# Altium schematic sheet lab_1_arhipov_usb_i2c.SchDoc: =title_line_1 + title_line_2
size 420 x 297 mm; SheetNumber: n
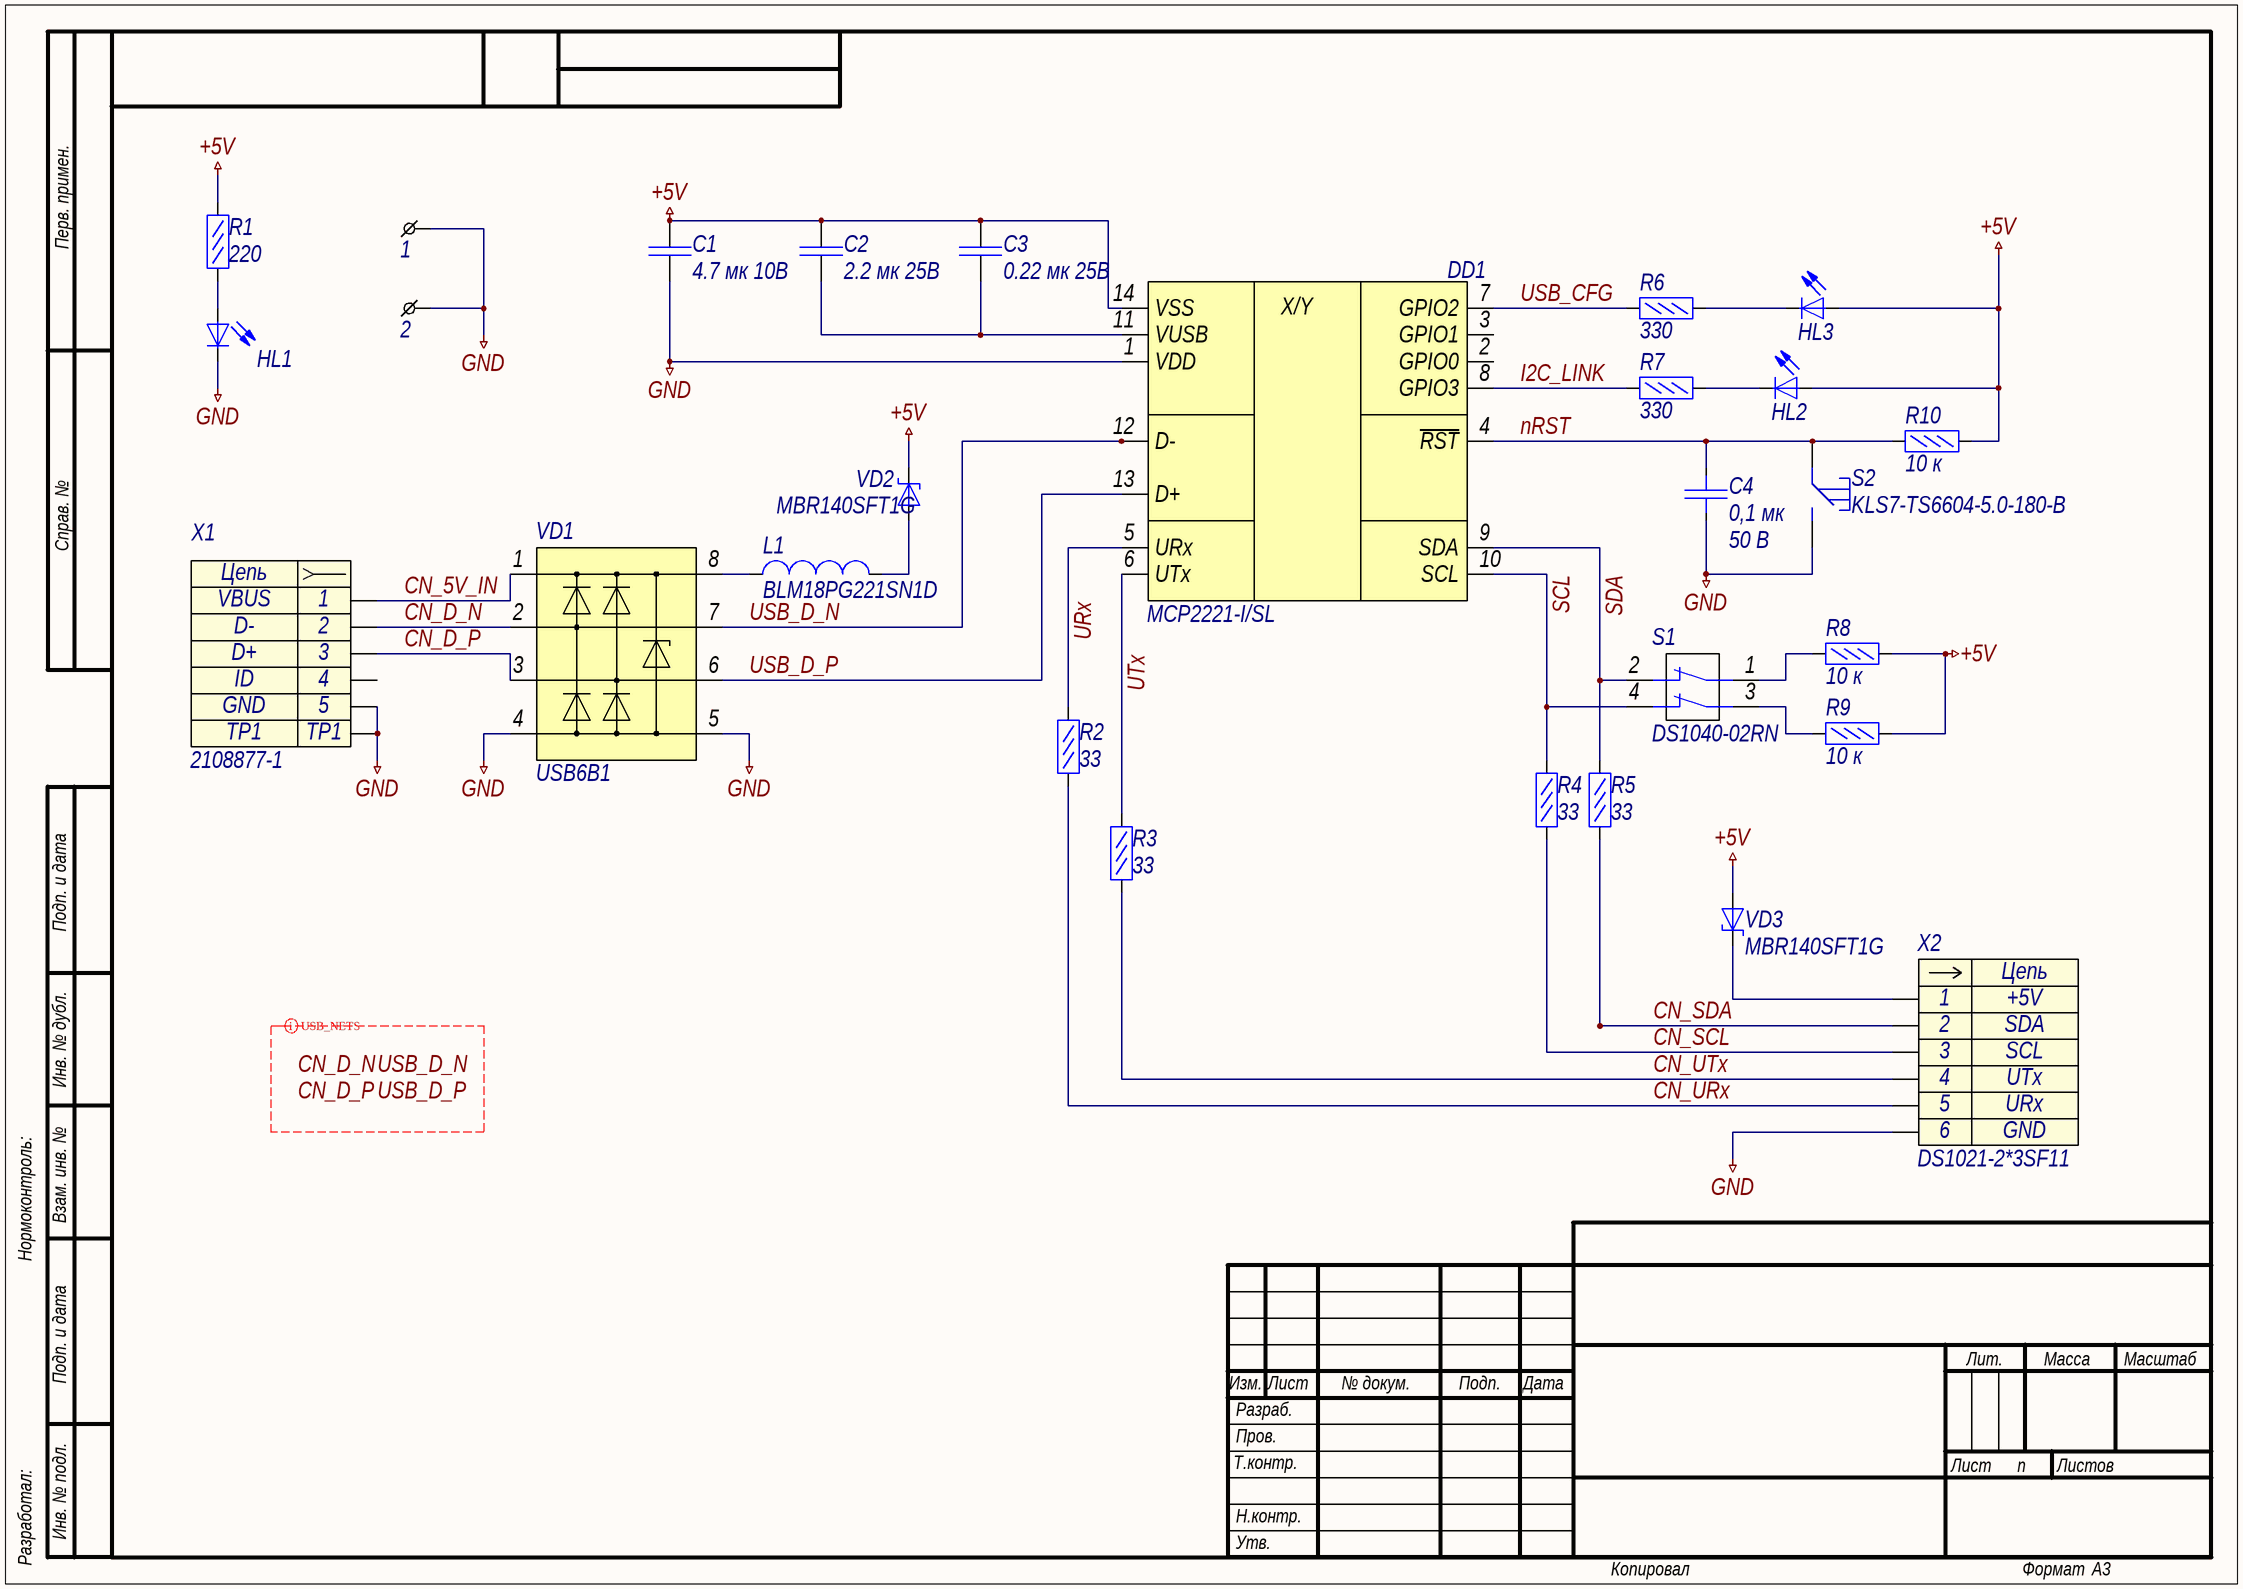
[diagram p0: lab_1_arhipov_usb_i2c.SchDoc]

## Parts
1  MOUNTING_HOLE  [HOLE_1,6X3,3]  (value not drawn)
2  MOUNTING_HOLE  [HOLE_1,6X3,3]  (value not drawn)
C1  4.7 мк 10В  [C0805]
C2  2.2 мк 25В  [C1206]
C3  0.22 мк 25В  [smd2220]
C4  0,1 мк  Напряжение: 50 В  [C0603]
DD1  MCP2221-I/SL  [SOIC127P600X175-14N]
HL1  KP-1608SGC  [D0603]  (value not drawn)
HL2  KP-1608SGC  [D0603]  (value not drawn)
HL3  KP-1608SGC  [D0603]  (value not drawn)
L1  BLM18PG221SN1D  [L0603]
R1  220  [R0603]
R2  33  [R0603]
R3  33  [R0603]
R4  33  [R0603]
R5  33  [R0603]
R6  330  [R0603]
R7  330  [R0603]
R8  10 к  [R0603]
R9  10 к  [R0603]
R10  10 к  [R0603]
S1  DS1040-02RN  [DS1040-02RN]
S2  KLS7-TS6604-5.0-180-B  [KLS7-TS6604_500]
VD1  USB6B1  [SO-8]
VD2  MBR140SFT1G  [SOD-123FL_290X180X98]
VD3  MBR140SFT1G  [SOD-123FL_290X180X98]
X1  2108877-1  [2108877-1]
X2  DS1021-2*3SF11  [PLS-2,54-2X3-THT-V]

## Nets
+5V: C1.2 C2.2 C3.2 DD1.14(VSS) HL2.1(A) HL3.1(A) R1.2 R8.2 R9.2 R10.2 VD2.2(K) VD3.1(A)
GND: 1.1 2.1 C1.1 C4.1 DD1.1(VDD) HL1.2(K) S2.2 VD1.4 VD1.5 X1.5 X1.TP1 X2.6
CN_5V_IN: VD1.1 X1.1
CN_D_N: VD1.2 X1.2
CN_D_P: VD1.3 X1.3
CN_SCL: R4.1 X2.3
CN_SDA: R5.1 X2.2
CN_URx: R2.1 X2.5
CN_UTx: R3.1 X2.4
I2C_LINK: DD1.8(GPIO3) R7.1
nRST: C4.2 DD1.4(~{RST}) R10.1 S2.1
SCL: DD1.10(SCL) R4.2 S1.4
SDA: DD1.9(SDA) R5.2 S1.2
URx: DD1.5(URx) R2.2
USB_CFG: DD1.7(GPIO2) R6.1
USB_D_N: DD1.12(D-) VD1.7
USB_D_P: DD1.13(D+) VD1.6
UTx: DD1.6(UTx) R3.2
NetC2_1: C2.1 C3.1 DD1.11(VUSB)
NetHL1_1: HL1.1(A) R1.1
NetHL2_2: HL2.2(K) R7.2
NetHL3_2: HL3.2(K) R6.2
NetL1_1: L1.1 VD1.8
NetL1_2: L1.2 VD2.1(A)
NetR8_1: R8.1 S1.1
NetR9_1: R9.1 S1.3
NetVD3_2: VD3.2(K) X2.1

Not connected (* = marked no-connect by the designer): DD1 2(GPIO0) 3(GPIO1); X1 4

## Layout directives
differential pair; rule Differential Pairs Routing [Pref Gap = 0.254mm    Min Gap  = 0.15mm    Max Gap  = 0.254mmPref Width = 0.381mm    Min Width  = 0.155mm    Max Width  = 0.381mm]; differential pair class USB_SIGNALS: CN_D_N, CN_D_P, USB_D_N, USB_D_P

## Notes on the sheet
- Labels drawn without touching a wire or pin: CN_D_N, CN_D_P, USB_D_N, USB_D_P
- Перв. примен.
- Справ. №
- Подп. и дата
- Инв. № дубл.
- Нормоконтроль:
- Взам. инв. №
- Изм.
- Лист
- № докум.
- Подп.
- Дата
- Лит.
- Масса
- Масштаб
- Т.контр.
- Пров.
- Разраб.
- Листов
- Разработал:
- Инв. № подл.
- Н.контр.
- Утв.
- Копировал
- Формат
- А3
- (in symbol 2108877-1_micro_usb-b) Цепь
- (in symbol DS1021-2*3SF11) Цепь
- (in symbol mcp2221) X/Y

## Library data of the parts
1 2 = Отверстие 1,6x3,3: id: fstn0011; Описание: Отверстие под М1,5; Диаметр отверстия: 1,6 мм; Параметры металлизации: 3,3 мм; Наименование: Отверстие 1,6x3,3
C1 = c0004: =Описание; ID: c0004; Фамилия: Архипов; Описание: Конденсатор чип 0805 4.7 мкФ 10 В; Наименование: CL21F475ZPFNNNE; Производитель: Samsung electro-mechanics; Отклонение: ±10 %; Рабочие температуры: от -55 °С до +125 °С; Корпус: 0805; Номинал: 4.7 мк 10В; Номинальное напряжение: 10В; HelpURL: https://static6.arrow.com/aropdfconversion/24268746ef1013a85114e321d5aafbc0d1e19c82/cl21f475zpfnnn_specsheet.pdf
C2 = c0003: =Описание; ID: c0003; Фамилия: Архипов; Описание: Конденсатор чип 1206 2.2 мкФ 25 В; Наименование: CL31B225KAHNNNE; Производитель: Samsung electro-mechanics; Отклонение: ±10 %; Рабочие температуры: от -55 °С до +125 °С; Корпус: 1206; Номинал: 2.2 мк 25В; Номинальное напряжение: 25В; HelpURL: https://www.datasheets360.com/pdf/7863126215795052319
C3 = c0002: =Описание; ID: c0002; Фамилия: Архипов; Описание: Конденсатор чип 0603 0.22 мкФ 25 В; Наименование: CL10B224KA8NNNC; Производитель: Samsung electro-mechanics; Отклонение: ±10 %; Рабочие температуры: от -55 °С до +125 °С; Корпус: 0603; Номинал: 0.22 мк 25В; Номинальное напряжение: 25 В; HelpURL: http://www.farnell.com/datasheets/2710631.pdf
C4 = CL10B104KB8NNN: Конденсатор; id: c0007; Фамилия: Черемный; Описание: Конденсатор керамический 0603 0,1 мкФ 50 В ±10 % X7R; Производитель: Samsung; Корпус: 0603; Отклонение: ±10 %; ТКЕ: X7R; Примечание: В наименовании убрана последняя буква, обозначающая упаковку; ClassName: *; Наименование: CL10B104KB8NNN; Номинал: 0,1 мк; HelpURL: http://weblib.samsungsem.com/mlcc/mlcc-ec-data-sheet.do?partNumber=CL10B104KB8NNN
DD1 = mcp2221
HL1-HL3 = KP-1608SGC: id: led0004; Фамилия: Капустин; Описание: Светодиод зеленый SMD 0603; Производитель: Kingbright; Цвет: Зеленый; Максимальное обратное напряжение: 5 В; Прямой ток: 20 мА; Максимальное прямое напряжение: 2,5 В; Максимальный обратный ток: 11 мкА; Максимальный импульсный прямой ток: 140 мА; Температура окружающей среды (корпуса), мин#: -40 °C; Температура окружающей среды (корпуса), макс#: +85 °C; Примечание: Не найти документацию на свйте производителя; ClassName: *; Наименование: KP-1608SGC; Корпус: D0603; HelpURL: http://www.farnell.com/datasheets/2045827.pdf?_ga=2.72147859.1066726363.1573580702-223521920.1573064505
L1 = BLM18PG221SN1D: id: ind0014; Фамилия: Капустин; Описание: Ферритовая бусина 220 Ом @ 100МГц; Производитель: Murata; Номинал: 220 Ом; Индуктивность: 220 Ом @ 100 МГц; Отклонение: ±25%; Сопротивление обмотки: 0,1 Ом; Максимальный ток: 1,4 А; Добротность: не указана; Температура окружающей среды (корпуса), мин#: -55 °C; Температура окружающей среды (корпуса), макс#: +125 °C; Корпус: 0603; ClassName: *; Наименование: BLM18PG221SN1D; HelpURL: https://www.murata.com/en-eu/products/productdetail?partno=BLM18PG221SN1%23
R1 = RC0603FR-07220RL: Резистор 0,063Вт; id: r0232; Фамилия: Капустин; Описание: Резистор чип 0603 220 Ом 0,1 Вт ±1 %; Производитель: YAGEO; Отклонение: ±1 %; Напряжение: 75 В; Температурный коэффициент сопротивления: 200 ppm; Температура окружающей среды (корпуса), мин#: -55 °C; Температура окружающей среды (корпуса), макс#: +155 °C; Корпус: 0603; ClassName: *; Наименование: RC0603FR-07220RL; Номинал: 220; HelpURL: https://www.yageo.com/upload/media/product/products/datasheet/rchip/PYu-RC_Group_51_RoHS_L_10.pdf
R2-R5 = RC0603FR-0733RL: Резистор 0,063Вт; id: r0214; Фамилия: Капустин; Описание: Резистор чип 0603 33 Ом 0,1 Вт ±1 %; Производитель: YAGEO; Отклонение: ±1 %; Напряжение: 75 В; Температурный коэффициент сопротивления: 200 ppm; Температура окружающей среды (корпуса), мин#: -55 °C; Температура окружающей среды (корпуса), макс#: +155 °C; Корпус: 0603; ClassName: *; Наименование: RC0603FR-0733RL; Номинал: 33; HelpURL: https://www.yageo.com/upload/media/product/products/datasheet/rchip/PYu-RC_Group_51_RoHS_L_10.pdf
R6 R7 = RC0603FR-07330RL: Резистор 0,063Вт; id: r0034; Фамилия: Капустин; Описание: Резистор чип 0603 300 Ом 0,1 Вт ±1 %; Производитель: YAGEO; Отклонение: ±1 %; Напряжение: 75 В; Температурный коэффициент сопротивления: 100 ppm; Температура окружающей среды (корпуса), мин#: -55 °C; Температура окружающей среды (корпуса), макс#: +155 °C; Корпус: 0603; ClassName: *; Наименование: RC0603FR-07330RL; Номинал: 330; HelpURL: https://www.yageo.com/upload/media/product/products/datasheet/rchip/PYu-RC_Group_51_RoHS_L_10.pdf
R8-R10 = RC0603FR-0710KL: Резистор 0,063Вт; id: r0006; Фамилия: Капустин; Описание: Резистор чип 0603 10 кОм 0,1 Вт ±1 %; Производитель: YAGEO; Отклонение: ±1 %; Напряжение: 75 В; Температурный коэффициент сопротивления: 200 ppm; Температура окружающей среды (корпуса), мин#: -55 °C; Температура окружающей среды (корпуса), макс#: +155 °C; Корпус: 0603; ClassName: *; Наименование: RC0603FR-0710KL; Номинал: 10 к; HelpURL: https://www.yageo.com/upload/media/product/products/datasheet/rchip/PYu-RC_Group_51_RoHS_L_10.pdf
S1 = DS1040-02RN_1: id: sw0002; Описание: 2-х позиционный движковый переключатель; Производитель: Connfly Electronic Co. LTD; Количество контактов: 2; Ток нагрузки: 100 мА @ 24 В; Сопротивление контакта: 100 мОм; Промывка: Запрещена; Температура окружающей среды (корпуса), мин#: -40 °C; Температура окружающей среды (корпуса), макс#: +105 °C; Корпус: 6,54х9,9х5,5; Капустин: Капустин; Наименование: DS1040-02RN; HelpURL: http://www.connfly.com/userfiles/image/UpLoadFile/File/2017/1/20/DS1040-N.pdf
S2 = KLS7-TS6604-5.0-180-B: id: sw0003; Капустин: Черемный; Описание: Тактовая кнопка поверхностного монтажа; Производитель: KLS; Количество контактов: 4; Ток нагрузки: 50 мА @ 12 В; Сопротивление контакта: 50 мОм; Промывка: Не указано (запрещена); Температура окружающей среды (корпуса), мин#: -20 °C; Температура окружающей среды (корпуса), макс#: +70 °C; Корпус: 6х6х3,5; Наименование: KLS7-TS6604-5.0-180-B; HelpURL: http://www.klsele.com/admin/product_upload/20120515130956KLS7-TS6604.pdf
VD1 = USB6B1: id: asmvd0007; Фамилия: Капустин; Описание: Диодная сборка для защиты USB; Производитель: ST Microelectronics; Температура окружающей среды (корпуса), мин#: -40 °C; Температура окружающей среды (корпуса), макс#: +85 °C; Наименование: USB6B1; Корпус: SO-8; HelpURL: https://www.st.com/resource/en/datasheet/usb6b1.pdf
VD2 VD3 = MBR140SFT1G: id: vd0004; Фамилия: Капустин; Описание: Диод Шоттки 40 В 1 А; Производитель: ON Semiconductor; Максимальное обратное напряжение: 40 В; Максимальный прямой ток: 1 А; Максимальное прямое напряжение: 0,88 В; Максимальный обратный ток: 10 мА @ Ta = 125°C; Максимальный импульсный прямой ток: 30 А; Температура окружающей среды (корпуса), мин#: -55 °C; Температура окружающей среды (корпуса), макс#: +125 °C; Корпус: SOD-123; ClassName: *; Наименование: MBR140SFT1G; HelpURL: https://www.onsemi.com/pub/Collateral/MBR140SFT1-D.PDF
X1 = 2108877-1_micro_usb-b: Contact_1: VBUS; Contact_2: D-; Contact_3: D+; Contact_4: ID; Contact_5: GND; Наименование: 2108877-1
X2 = DS1021-2*3SF11: Contact_01: +5V; Contact_02: SDA; Contact_03: SCL; Contact_04: UTx; Contact_05: URx; Contact_06: GND; id: cn0076; Фамилия: Капустин; Описание: PLS 6-ти контактный прямой двухрядный (2,54 мм); Производитель: Connfly Electronic Co. LTD; Количество контактов: 6; Цвет: Черный; Ток на контакт: 3 А; Напряжение: 250 В; Шаг: 2,54 мм; Семейство: PLS; Тип вывода: Прямой; Температура окружающей среды (корпуса), мин#: -40 °C; Температура окружающей среды (корпуса), макс#: +105 °C; Альтернатива: не указана; Ответная часть: DS1023-2*3S22; Контакт: отсутствует; ClassName: +5V; Наименование: DS1021-2*3SF11; HelpURL: http://www.connfly.com/userfiles/image/UpLoadFile/File/2015/1/29/DS1021.pdf